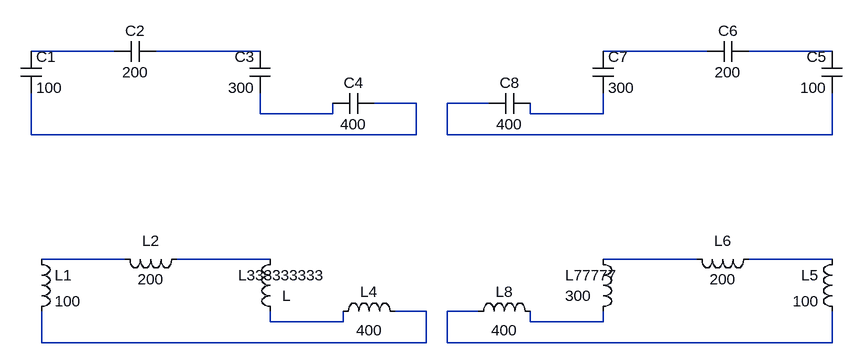
[diagram p0: schematic 04- Capacitor and wires.asc]
04- Capacitor and wires.asc, the LTspice schematic file:
Version 4.1
SHEET 1 1376 680
WIRE 224 128 96 128
WIRE 448 128 288 128
WIRE 1136 128 976 128
WIRE 1328 128 1200 128
WIRE 688 208 624 208
WIRE 800 208 736 208
WIRE 448 224 448 192
WIRE 560 224 560 208
WIRE 560 224 448 224
WIRE 864 224 864 208
WIRE 976 224 976 192
WIRE 976 224 864 224
WIRE 96 256 96 192
WIRE 688 256 688 208
WIRE 688 256 96 256
WIRE 736 256 736 208
WIRE 1328 256 1328 192
WIRE 1328 256 736 256
WIRE 240 448 112 448
WIRE 464 448 320 448
WIRE 1120 448 976 448
WIRE 1328 448 1200 448
WIRE 704 528 656 528
WIRE 784 528 736 528
WIRE 464 544 464 528
WIRE 576 544 576 528
WIRE 576 544 464 544
WIRE 864 544 864 528
WIRE 976 544 976 528
WIRE 976 544 864 544
WIRE 112 576 112 528
WIRE 704 576 704 528
WIRE 704 576 112 576
WIRE 736 576 736 528
WIRE 1328 576 1328 528
WIRE 1328 576 736 576
SYMBOL cap 80 128 R0
SYMATTR InstName C1
SYMATTR Value 100
SYMBOL cap 288 112 R90
WINDOW 0 0 32 VBottom 2
WINDOW 3 32 32 VTop 2
SYMATTR InstName C2
SYMATTR Value 200
SYMBOL cap 464 192 R180
WINDOW 0 24 56 Left 2
WINDOW 3 24 8 Left 2
SYMATTR InstName C3
SYMATTR Value 300
SYMBOL cap 560 224 R270
WINDOW 0 32 32 VTop 2
WINDOW 3 0 32 VBottom 2
SYMATTR InstName C4
SYMATTR Value 400
SYMBOL cap 1344 128 M0
SYMATTR InstName C5
SYMATTR Value 100
SYMBOL cap 1136 112 M90
WINDOW 0 0 32 VBottom 2
WINDOW 3 32 32 VTop 2
SYMATTR InstName C6
SYMATTR Value 200
SYMBOL cap 960 192 M180
WINDOW 0 24 56 Left 2
WINDOW 3 24 8 Left 2
SYMATTR InstName C7
SYMATTR Value 300
SYMBOL cap 864 224 M270
WINDOW 0 32 32 VTop 2
WINDOW 3 0 32 VBottom 2
SYMATTR InstName C8
SYMATTR Value 400
SYMBOL ind 96 432 R0
SYMATTR Value 100
SYMATTR InstName L1
SYMBOL ind 336 432 R90
WINDOW 3 31 56 VTop 2
WINDOW 0 3 56 VBottom 2
SYMATTR Value 200
SYMATTR InstName L2
SYMBOL ind 560 544 R270
WINDOW 3 3 56 VBottom 2
WINDOW 0 31 56 VTop 2
SYMATTR Value 400
SYMATTR InstName L4
SYMBOL ind 1344 432 M0
SYMATTR Value 100
SYMATTR InstName L5
SYMBOL ind 1104 432 M90
WINDOW 3 31 56 VTop 2
WINDOW 0 3 56 VBottom 2
SYMATTR Value 200
SYMATTR InstName L6
SYMBOL ind 960 544 M180
WINDOW 3 -2 40 Right 2
WINDOW 0 -2 72 Center 2
SYMATTR Value 300
SYMATTR InstName L77777
SYMBOL ind 880 544 M270
WINDOW 3 3 56 VBottom 2
WINDOW 0 31 56 VTop 2
SYMATTR Value 400
SYMATTR InstName L8
SYMBOL ind 480 544 R180
WINDOW 3 -2 40 Right 2
WINDOW 0 -2 72 Center 2
SYMATTR InstName L333333333

The netlist it stands for:
* 04- Capacitor and wires.asc
C1 N001 N005 100
C2 N002 N001 200
C3 N007 N002 300
C4 N007 N005 400
C5 N004 N006 100
C6 N003 N004 200
C7 N008 N003 300
C8 N008 N006 400
L1 N009 N013 100
L2 N010 N009 200
L4 N015 N013 400
L5 N012 N014 100
L6 N011 N012 200
L77777 N016 N011 300
L8 N016 N014 400
L333333333 N015 N010 L
.backanno
.end